# EAGLE design mq-4 (EAGLE 7.6.0)
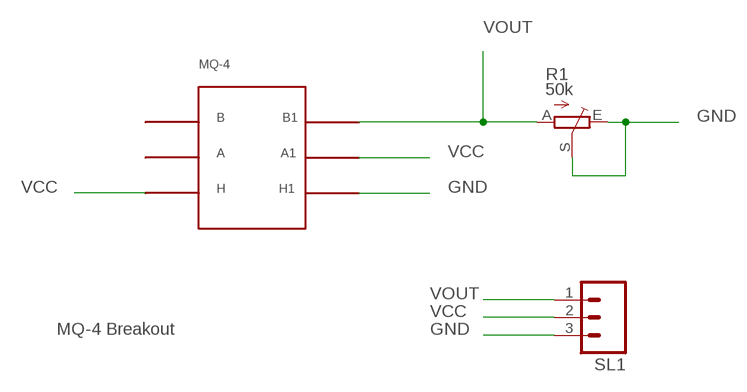
[diagram p0: schematic, sheet 1]

## Parts
R1  50k  TRIM_EU-B64Y  [B64Y]
SL1  M03  [03P]
U$1  MQ-4  [MQ-4]

## Nets
GND [gnd]: R1.E R1.S SL1.3 U$1.H1
VCC: SL1.2 U$1.A1 U$1.H
VOUT: R1.A SL1.1 U$1.B1
Unconnected: U$1.A U$1.B

## Notes on the sheet
- MQ-4 Breakout

## Library data of the parts
R1 = pot:TRIM_EU-: POTENTIOMETER
SL1 = con-amp-quick:M03: AMP QUICK CONNECTOR; OC_FARNELL: unknown; OC_NEWARK: unknown
U$1 = mq-x:MQ-4

## Net classes
0 default: width 1.27 mm, drill 0.61 mm, clearance 0.508 mm
1 gnd: width 0.914 mm, drill 0.254 mm

## Board
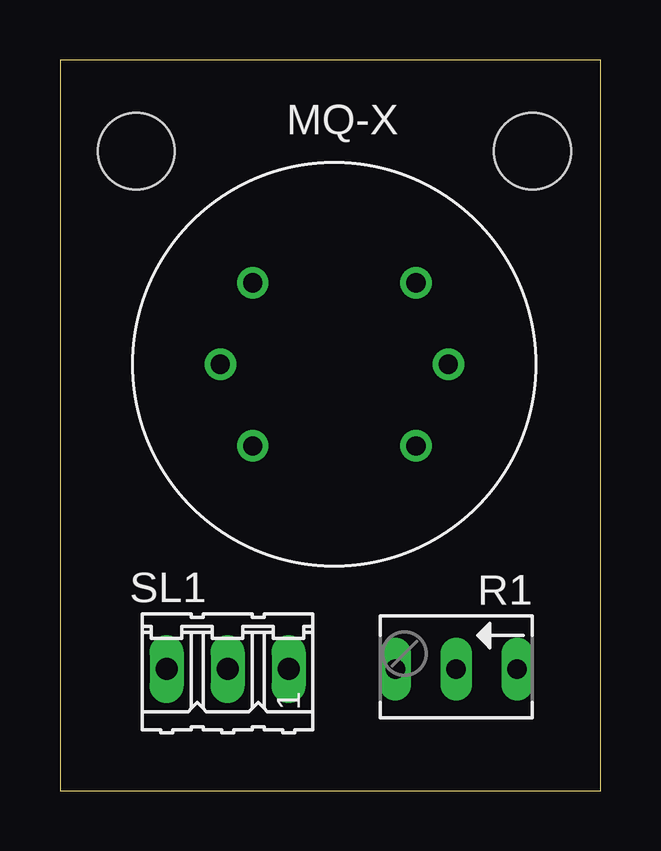
[diagram p1: board, top side]
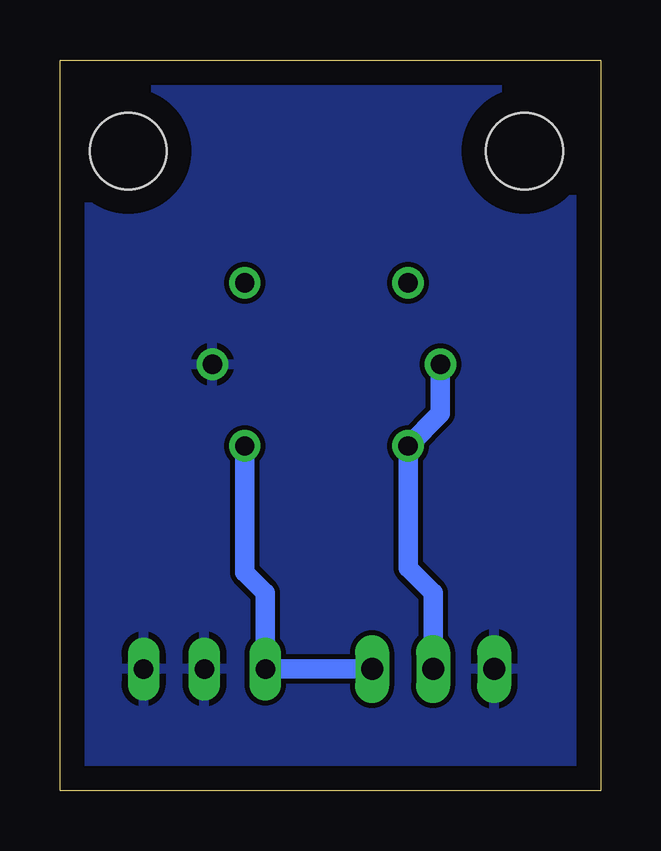
[diagram p2: board, bottom side, seen from below]

Size 22.53 x 30.47 mm. Coordinates in mm from the lower left corner, seen from the top.
Outline: 0,0 22.53,0 22.53,30.47 0,30.47 0,0
Copper layers (1*16): Top 0.035mm / dielectric 1.5mm / Bottom 0.035mm
Design rules "mq-4": minimum track width 10mil, minimum drill 24mil, track to track 0.205mm, track to pad 0.205mm, pad to pad 0.205mm, via to via 0.205mm, smd to smd 8mil, copper to edge 40mil, drill to drill 8mil, minimum pad ring 10mil, minimum via ring 8mil, stop-mask expansion 4mil, vias tented up to drill 0mil, thermal gap 10mil
Holes 3.2 mm at 3.17,26.67 19.68,26.67

### Footprints (pad centres in the part's own frame; a part is rotated, then mirrored left to right if it is on the bottom)
B64Y = drill 0.813 long: A 2.54,0; E -2.54,0; S 0,0
03P = drill 0.914 long: 1 -2.54,0; 2 0,0; 3 2.54,0
MQ-4 = drill 0.8: A -3.4,3.4; A1 -3.4,-3.4; B 3.4,3.4; B1 3.4,-3.4; H -4.75,0; H1 4.75,0

### Placement (x,y rotation side)
R1  16.51,5.08 180 top
SL1  6.99,5.08 180 top
U$1  11.43,17.78 0 top

### Tracks (layer width: path | path; a pad name or v marks a point on that pad's centre or on a via)
GND
  pour Bottom: 0,0 0,30.48 22.86,30.48 22.86,0
VCC
  Bottom 0.813: U$1.H 6.68,15.73 U$1.A1 8.03,9.3 6.99,8.26 SL1.2
VOUT
  Bottom 0.813: U$1.B1 14.83,9.12 13.97,8.26 R1.A SL1.1